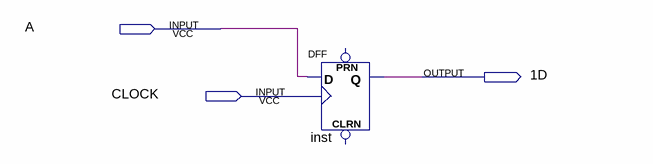
[diagram p0: schematic sheet]
// Quartus schematic Block1.bdf as structural Verilog: 1 symbols, 3 pins
module Block1 (
  input  A,
  input  CLOCK,
  output \1D 
);

  DFF inst (.CLK(CLOCK), .D(A), .Q(\1D ));  // open: CLRN, PRN
endmodule
